# EAGLE design A4a CubeCell (EAGLE 9.6.1)
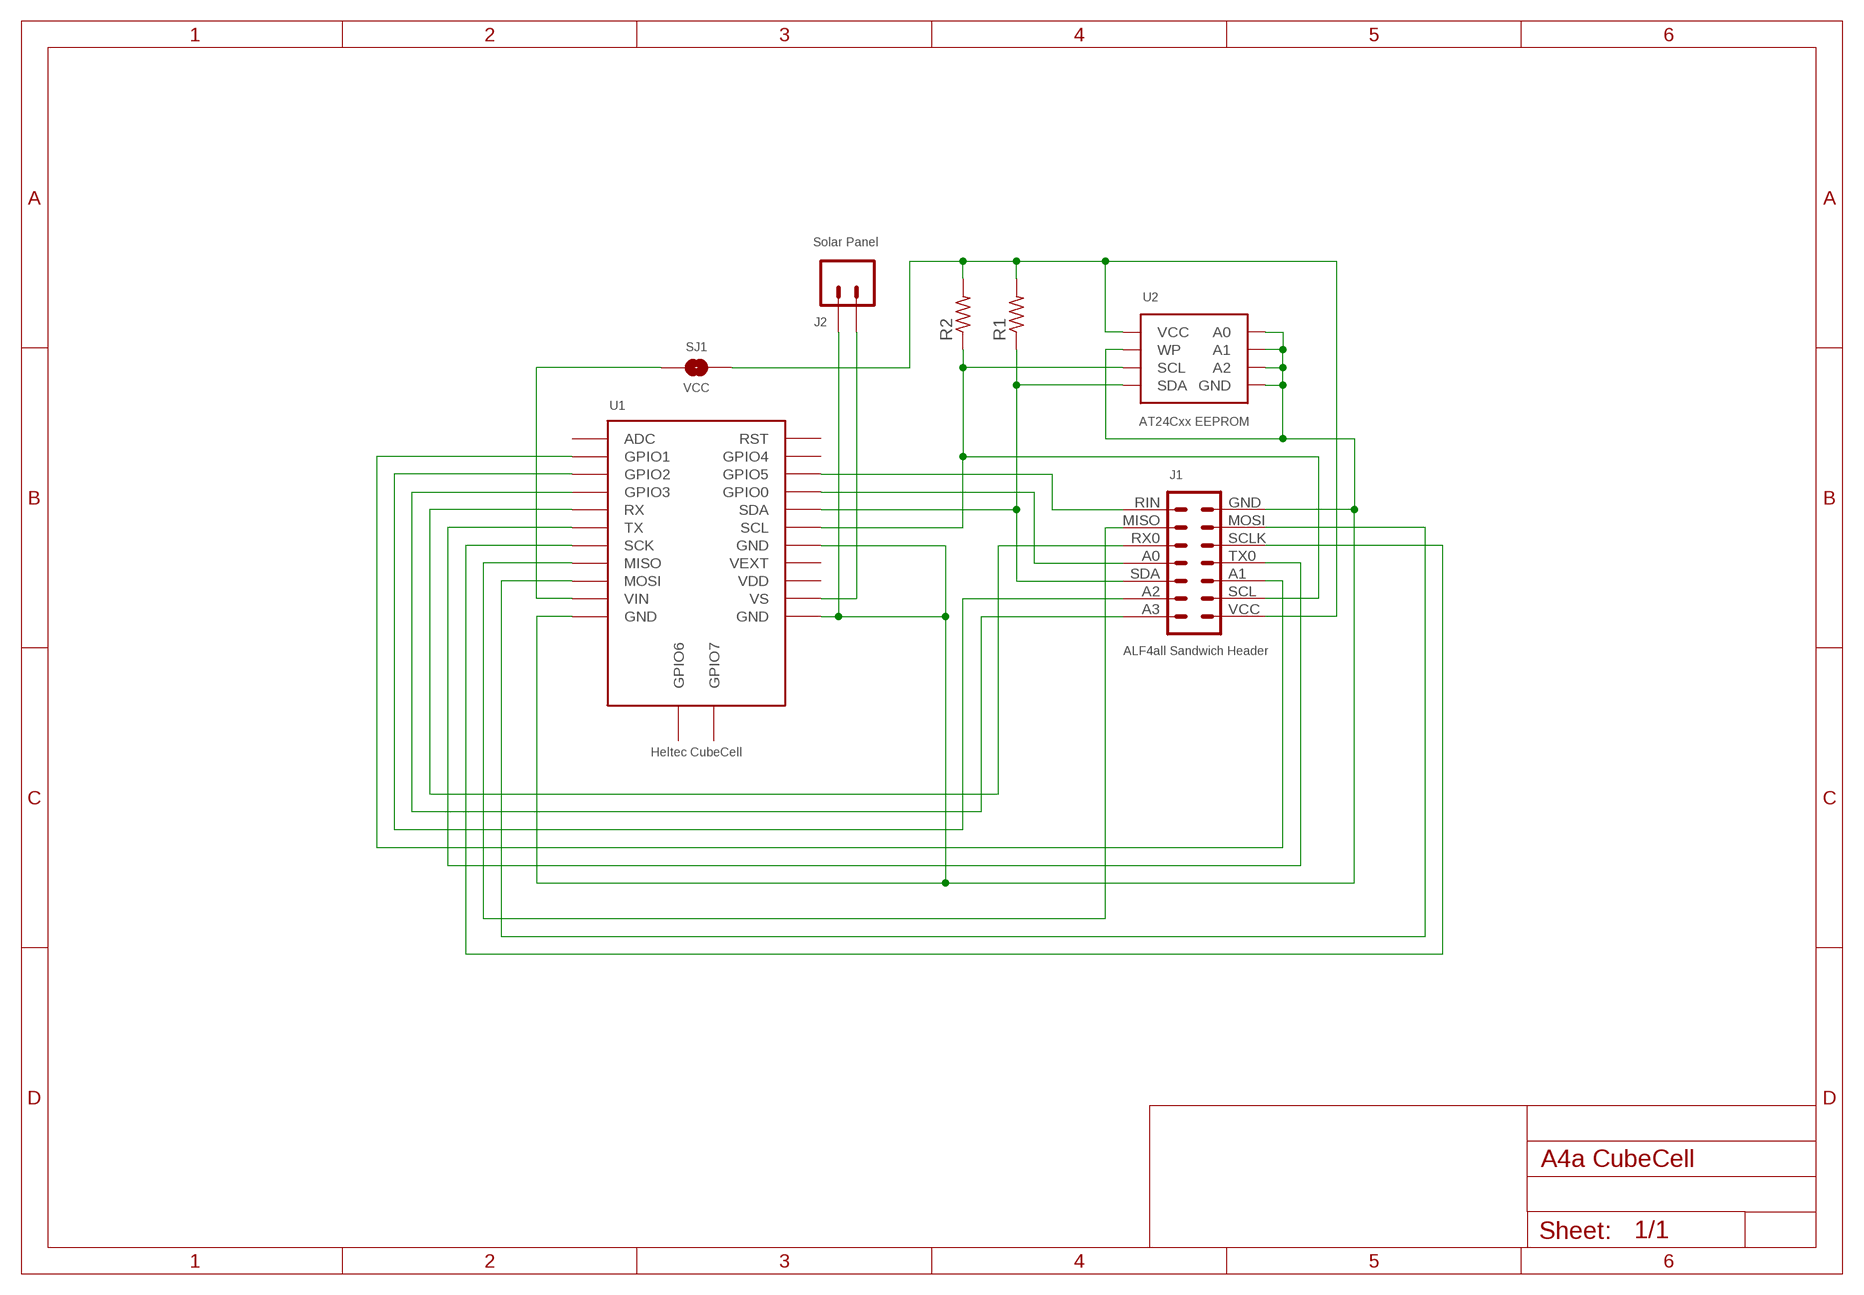
[diagram p0: schematic, sheet 1]

## Parts
J1  ALF4all Sandwich Header  HEADER-2X7-ALF4ALL-PROCESSOR-B  [CONN_2X7-ALF4ALL-PROCESSOR-B]
J2  Solar Panel  JST-PH2.0-2-MALE-HORIZONTALJST-PTH-2  [JST-PH2.0-2-HORIZONTAL]
R1  RESISTORR0805  [R0805]
R2  RESISTORR0805  [R0805]
SJ1  VCC  SJ  [SJ]
U1  Heltec CubeCell  HELTEC-CUBECELL  [HELTEC-CUBECELL]
U2  AT24Cxx EEPROM  AT24CXX-EEPROM-VIAS-4-5  [SOP-8-WITH-VIAS-4-5]

## Nets
GND: J1.GND J2.- U1.GND@11(GND) U1.GND@14(GND) U1.GND@18(GND) U2.P$1(A0) U2.P$2(A1) U2.P$3(A2) U2.P$4(GND) U2.P$4@VIA(GND) U2.P$7(WP)
N$1: J1.SCL R2.1 U1.SCL U2.P$6(SCL)
N$2: J1.SDA R1.1 U1.SDA U2.P$5(SDA) U2.P$5@VIA(SDA)
N$3: J1.A2 U1.GPIO2
N$4: J1.A3 U1.GPIO3
N$5: J1.A1 U1.GPIO1
N$6: J1.A0 U1.GPIO0
N$7: J1.TX0 U1.TX
N$8: J1.RX0 U1.RX
N$10: J1.SCLK U1.SCK
N$11: J1.MISO U1.MISO
N$12: J1.MOSI U1.MOSI
N$13: J1.RIN U1.GPIO5
N$14: J2.+ U1.VS
N$15: SJ1.1 U1.VIN
VCC: J1.VCC R1.2 R2.2 SJ1.2 U2.P$8(VCC)
Unconnected: U1.ADC U1.GPIO4 U1.GPIO6 U1.GPIO7 U1.RST U1.VDD U1.VEXT

## Library data of the parts
J1 = digitalconcepts:HEADER-2X7-ALF4ALL-PROCESSOR-B: ALF4all 'Sandwixh' Processor (Bottom) 2x7 Pin Header and earthed 1x1 locator pins for ALF4all 'Sandwich' Processor/RFM95W PCBs Header soldered to underside of PCB
J2 = digitalconcepts:JST-PH2.0-2-MALE-HORIZONTAL: Multi connection point. Often used as Generic Header-pin footprint for 0.1 inch spaced/style header connections On any of the 0.1 inch spaced packages, you can populate with these: Break Away Headers - Straight <https://www.sparkfun.com/products/116> (PRT-00116) Break Away Male Headers - Right Angle <https://www.sparkfun.com/products/553> (PRT-00553) Female Headers <https://www.sparkfun.com/products/115> (PRT-00115) Break Away Headers - Machine Pin <https://www.sparkfun.com/products/117> (PRT-00117) Break Away Female Headers - Swiss Machine Pin <https://www.sparkfun.com/products/743> (PRT-00743) For SCREWTERMINALS and SPRING TERMINALS visit here: Screw Terimnals on SparkFun.com <https://www.sparkfun.com/search/results?term=Screw+Terminals> (5mm/3.5mm/2.54mm spacing) This device is also useful as a general connection point to wire up your design to another part of your project. Our various solder wires solder well into these plated through hole pads. Hook-Up Wire - Assortment (Stranded, 22 AWG) <https://www.sparkfun.com/products/11375> (PRT-11375) Hook-Up Wire - Assortment (Solid Core, 22 AWG) <https://www.sparkfun.com/products/11367> (PRT-11367) View the entire wire category on our website here <https://www.sparkfun.com/categories/141> Special notes: Molex polarized connector foot print use with: PRT-08233 with associated crimp pins and housings. 2.54_SCREWTERM for use with PRT-10571. 3.5mm Screw Terminal footprints for PRT-08084 5mm Screw Terminal footprints for use with PRT-08432; PROD_ID: CONN-09863; SKU: PRT-09914
R1 R2 = digitalconcepts:RESISTOR: Resistor; SPICEPREFIX: R
SJ1 = digitalconcepts:SJ: Solder Jumper
U1 = digitalconcepts:HELTEC-CUBECELL: Heltec CubeCell Development Board
U2 = digitalconcepts:AT24CXX-EEPROM-VIAS-4-5: AT24Cxx EEPROM SOP-8

## Board
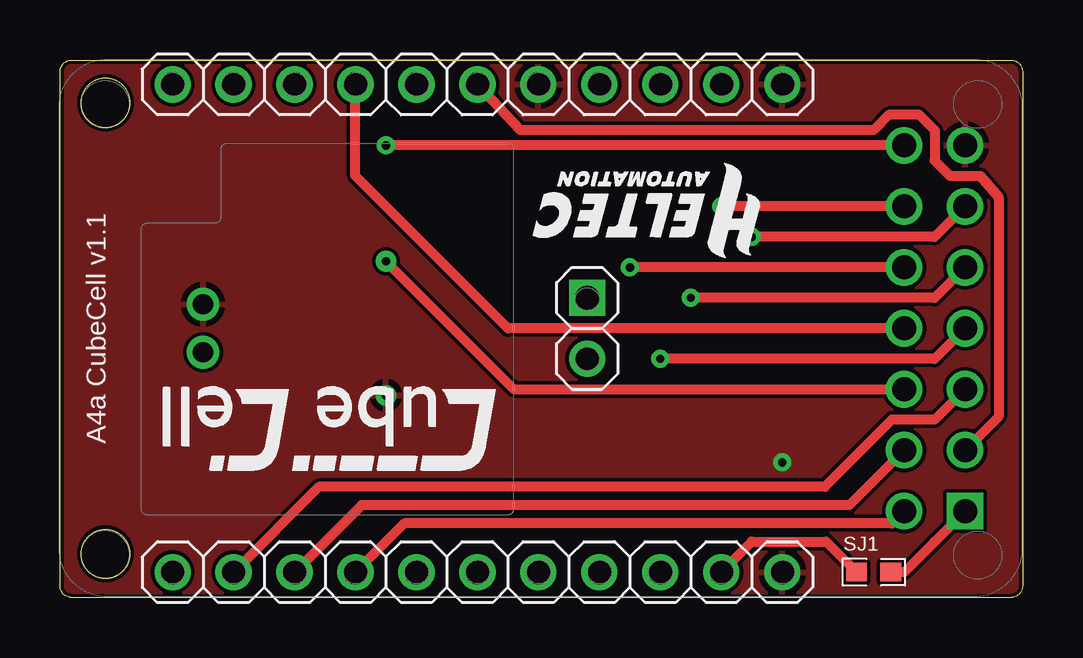
[diagram p1: board, top side]
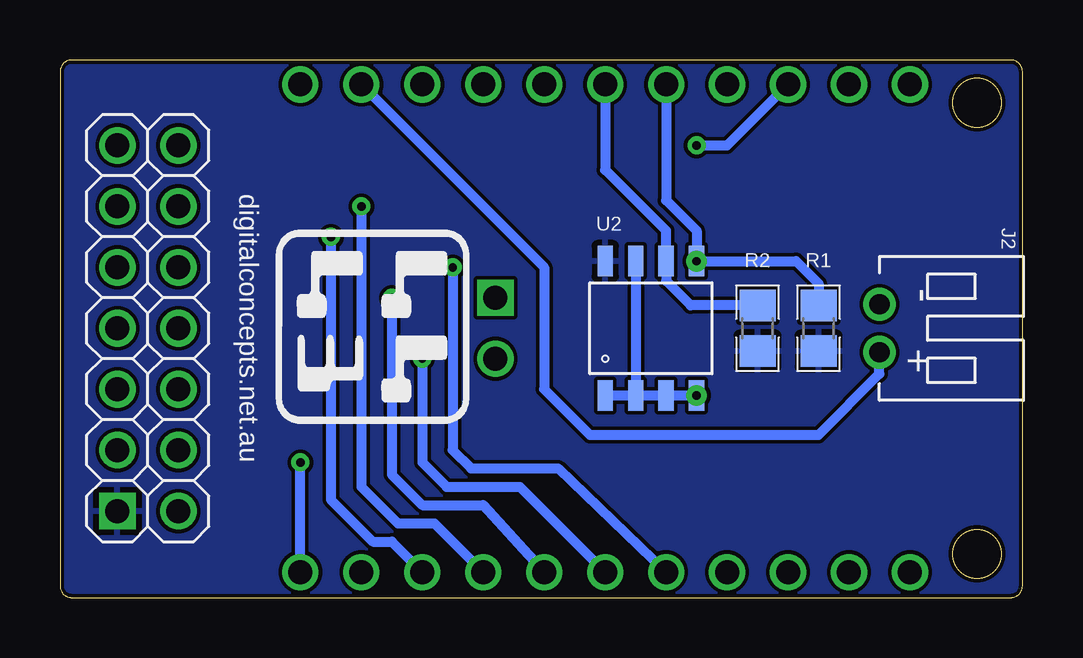
[diagram p2: board, bottom side, seen from below]

Size 40.11 x 22.4 mm. Coordinates in mm from the lower left corner, seen from the top.
Outline: 39.78,22.37 39.81,22.36 39.84,22.35 39.86,22.33 39.89,22.31 39.92,22.3 39.94,22.28 39.96,22.25 39.98,22.23 40.01,22.21 40.02,22.18 40.04,22.15 40.06,22.12 40.08,22.06 40.09,22.03 40.1,22 40.1,21.97 40.11,21.93 40.11,0.47 40.1,0.43 40.1,0.4 40.09,0.37 40.08,0.34 40.06,0.28 40.04,0.25 40.02,0.22 40.01,0.19 39.98,0.17 39.96,0.15 39.94,0.12 39.92,0.1 39.89,0.09 39.86,0.07 39.84,0.05 39.81,0.04 39.78,0.03 39.75,0.02 39.71,0.01 39.68,0 39.65,0 0.46,0 0.43,0 0.39,0.01 0.36,0.02 0.33,0.03 0.27,0.05 0.24,0.07 0.22,0.09 0.19,0.1 0.17,0.12 0.14,0.15 0.12,0.17 0.1,0.19 0.08,0.22 0.07,0.25 0.05,0.28 0.04,0.31 0.03,0.34 0.02,0.37 0.01,0.4 0,0.43 0,0.47 0,21.93 0,21.97 0.01,22 0.02,22.03 0.03,22.06 0.04,22.09 0.05,22.12 0.07,22.15 0.08,22.18 0.1,22.21 0.12,22.23 0.14,22.25 0.17,22.28 0.19,22.3 0.22,22.31 0.24,22.33 0.27,22.35 0.3,22.36 0.33,22.37 0.36,22.38 0.39,22.39 0.43,22.4 0.46,22.4 39.65,22.4 39.68,22.4 39.71,22.39 39.75,22.38 39.78,22.37
Outline: circle at 1.9,20.62 radius 1.02
Outline: circle at 1.9,1.82 radius 1.02
Copper layers (1*16): Top 0.035mm / dielectric 1.5mm / Bottom 0.035mm
Design rules "default *": minimum track width 6mil, minimum drill 0.35mm, track to track 6mil, track to pad 6mil, pad to pad 6mil, via to via 6mil, smd to smd 6mil, copper to edge 6mil, drill to drill 6mil, minimum pad ring 10mil, minimum via ring 8mil, stop-mask expansion 4mil, vias tented up to drill 0mil, thermal gap 10mil

### Footprints (pad centres in the part's own frame; a part is rotated, then mirrored left to right if it is on the bottom)
CONN_2X7-ALF4ALL-PROCESSOR-B = drill 1 pad 1.524: A0 7.62,2.54; A1 5.08,0; A2 2.54,2.54; A3 0,2.54; GND 15.24,0; MISO 12.7,2.54; MOSI 12.7,0; RIN 15.24,2.54; RX0 10.16,2.54; SCL 2.54,0; SCLK 10.16,0; SDA 5.08,2.54; TX0 7.62,0 | drill 1 pad 1.524 square: VCC 0,0
JST-PH2.0-2-HORIZONTAL = drill 0.85: + 1,0; - -1,0
R0805 = smd 1.3 x 1.5: 1 -0.95,0; 2 0.95,0
SJ = smd 0.864 x 0.762: 1 -0.711,0; 2 0.711,0
HELTEC-CUBECELL = drill 1: ADC 0,0; GND@11 0,25.4; GND@14 -20.32,25.4; GND@18 -20.32,15.24; GPIO0 -20.32,7.62; GPIO1 0,2.54; GPIO2 0,5.08; GPIO3 0,7.62; GPIO4 -20.32,2.54; GPIO5 -20.32,5.08; GPIO6 -8.89,17.272; MISO 0,17.78; MOSI 0,20.32; RST -20.32,0; RX 0,10.16; SCK 0,15.24; SCL -20.32,12.7; SDA -20.32,10.16; TX 0,12.7; VDD -20.32,20.32; VEXT -20.32,17.78; VIN 0,22.86; VS -20.32,22.86 | drill 1 square: GPIO7 -11.43,17.272
SOP-8-WITH-VIAS-4-5 = smd 0.635 x 1.27: P$1 -1.905,-2.794; P$2 -0.635,-2.794; P$3 0.635,-2.794; P$4 1.905,-2.794; P$5 1.905,2.794; P$6 0.635,2.794; P$7 -0.635,2.794; P$8 -1.905,2.794 | drill 0.35 pad 0.61: P$4@VIA 1.905,-2.794; P$5@VIA 1.905,2.794

### Placement (x,y rotation side)
J1  37.71,3.6 90 top
J2  5.96,11.22 270 bottom
R1  8.5,11.22 270 bottom
R2  11.04,11.22 270 bottom
SJ1  33.9,1.06 0 top
U1  4.69,1.06 270 top
U2  15.49,11.22 0 bottom

### Tracks (layer width: path | path; a pad name or v marks a point on that pad's centre or on a via)
GND  (via drill 0.35)
  Bottom 0.406: U2.P$1 U2.P$2 | U2.P$2 U2.P$3 U2.P$4@VIA | U2.P$7 U2.P$2 | U1.GND@11 v30.09,5.63
  pour Top: -1.66,23.92 41.52,23.92 41.52,-1.48 -1.66,-1.48
N$1
  Top 0.406: J1.SCL 39.11,7.54 39.11,16.68 38.35,17.57 37.08,17.57 36.44,18.21 36.44,19.48 35.81,20.11 34.54,20.11 33.9,19.48 19.17,19.48 U1.SCL
  Bottom 0.406: U1.SCL 17.39,17.83 14.85,15.29 U2.P$6 14.85,13.2 13.83,12.17 R2.1
N$2
  Top 0.406: U2.P$5@VIA 18.92,8.68 J1.SDA
  Bottom 0.406: U1.SDA 14.85,16.56 13.58,15.29 U2.P$5@VIA 9.43,14.02 8.5,13.09 R1.1
N$3
  Top 0.406: J1.A2 32.89,3.86 12.57,3.86 U1.GPIO2
N$4
  Top 0.406: J1.A3 34.66,3.09 14.34,3.09 U1.GPIO3
N$5
  Top 0.406: J1.A1 36.44,7.41 34.66,7.41 31.87,4.62 10.79,4.62 U1.GPIO1
N$6
  Top 0.406: J1.A0 18.66,11.22 12.31,17.57 U1.GPIO0
N$7  (via drill 0.35)
  Top 0.406: J1.TX0 36.44,9.95 v25.01,9.95
  Bottom 0.406: v25.01,9.95 25.01,5.63 24,4.62 20.95,4.62 U1.TX
N$8  (via drill 0.35)
  Top 0.406: J1.RX0 v23.74,13.76
  Bottom 0.406: v23.74,13.76 23.74,6.14 22.98,5.38 19.35,5.38 U1.RX
N$10  (via drill 0.35)
  Top 0.406: J1.SCLK 36.44,12.49 v26.28,12.49
  Bottom 0.406: v26.28,12.49 26.28,5.13 25.01,3.86 22.47,3.86 U1.SCK
N$11  (via drill 0.35)
  Top 0.406: J1.MISO v27.55,16.3
  Bottom 0.406: v27.55,16.3 27.55,4.62 26.03,3.09 24.5,3.09 U1.MISO
N$12  (via drill 0.35)
  Top 0.406: J1.MOSI 36.44,15.03 v28.82,15.03
  Bottom 0.406: v28.82,15.03 28.82,4.08 27.07,2.33 26.28,2.33 U1.MOSI
N$13  (via drill 0.35)
  Top 0.406: J1.RIN v13.58,18.84
  Bottom 0.406: v13.58,18.84 12.31,18.84 U1.GPIO5
N$14
  Bottom 0.406: J2.+ 5.96,9.32 8.5,6.78 18.03,6.78 19.93,8.68 19.93,13.76 U1.VS
N$15
  Top 0.406: U1.VIN 28.82,2.33 31.92,2.33 SJ1.1
VCC
  Top 0.406: J1.VCC 36.44,2.33 35.17,1.06 SJ1.2
  pour Bottom: 40.89,23.29 -1.02,23.29 -1.02,-0.84 40.89,-0.84

### Text on the board
tPlace: A4a CubeCell v1.1
bPlace: digitalconcepts.net.au